# Altium project UVLO_MODULE.PrjPcb
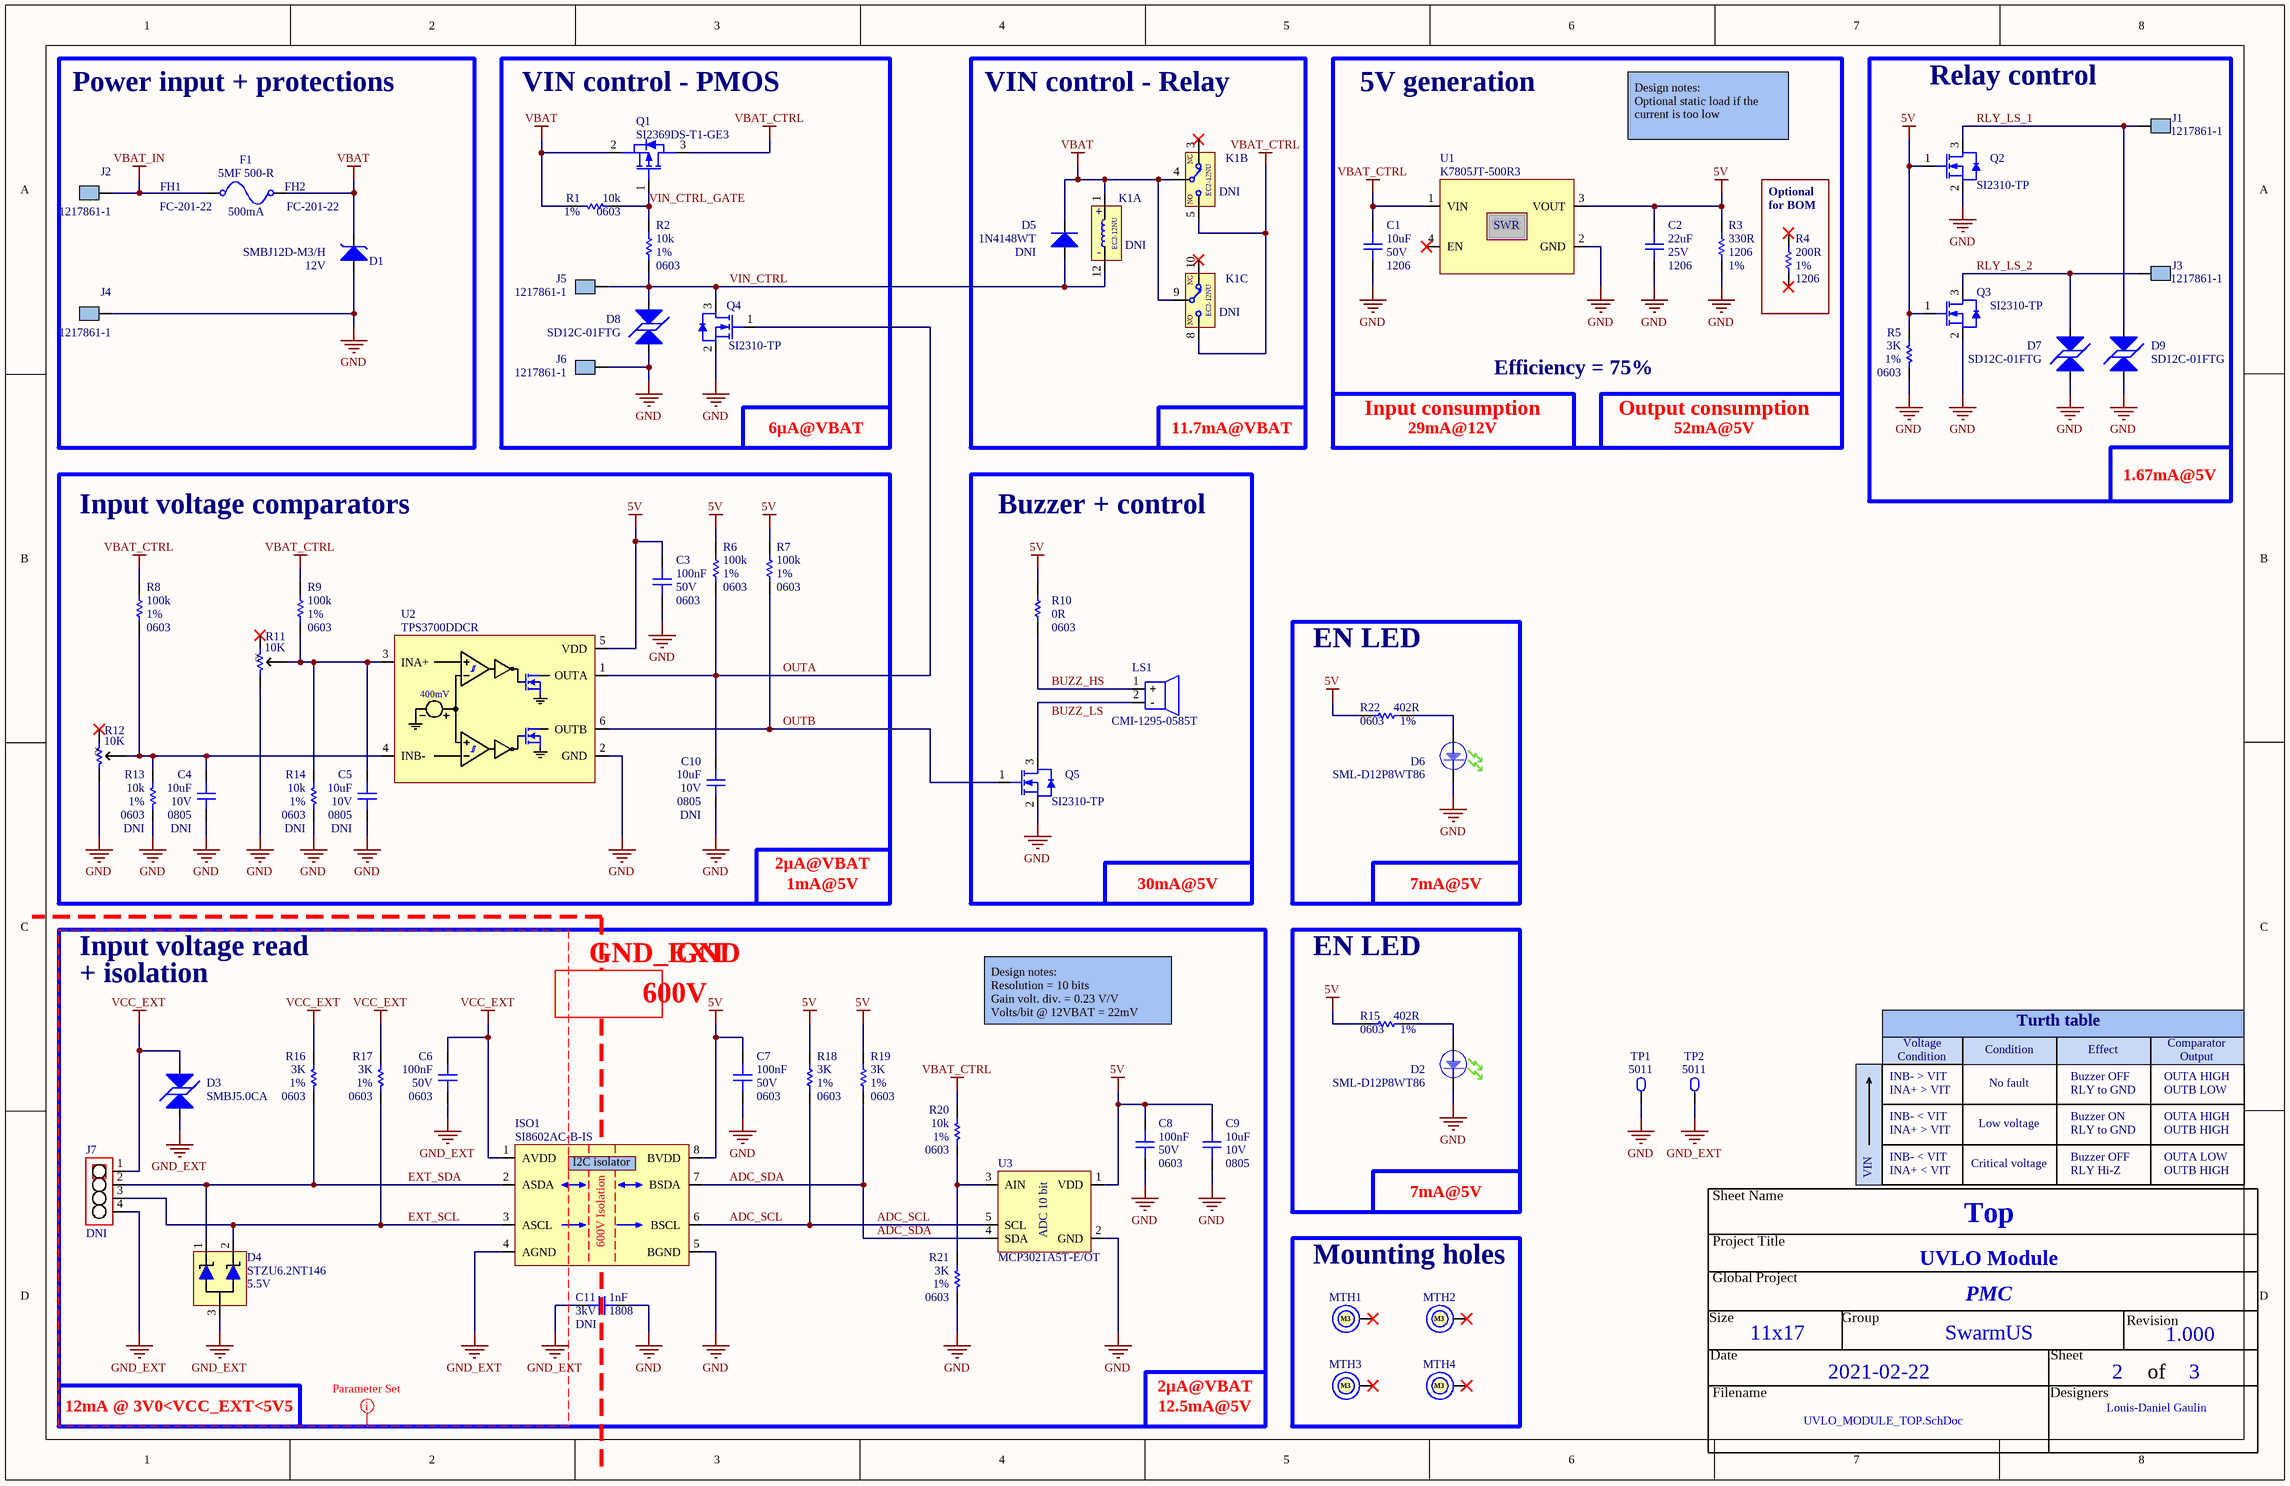
[diagram p0: UVLO_MODULE_TOP.SchDoc]
Project_Date: 2021-02-22; Project_Designer1: Louis-Daniel Gaulin; Project_Global: PMC; Project_Group: SwarmUS; Project_Name: UVLO Module; Project_Revision: 1.000; Project_Stencil_Bot_Thickness: 0.1 MM; Project_Stencil_Top_Thickness: 0.1 MM
1 sheet, 69 parts. Net scope: hierarchical (ports join the sheet entries above them; power ports are global).
Board file: UVLO_MODULE.PcbDoc

## Sheet UVLO_MODULE_TOP.SchDoc
size Tabloid; SheetNumber: 2; SheetTotal: 3; Sheet_Name: Top; Size: 11x17

### Parts
C1  value 10uF  Package: 1206  Voltage Rating: 50V  [CAP_CER_1206]  (hidden comment: GRT31CR61H106KE01L)
C2  value 22uF  Package: 1206  Voltage Rating: 25V  [CAP_CER_1206]  (hidden comment: CL31A226KAHNNNE)
C3  value 100nF  Package: 0603  Voltage Rating: 50V  [CAP_CER_0603]  (hidden comment: CC0603KRX7R9BB104)
C4  value 10uF  Assembly Note: DNI  Package: 0805  Voltage Rating: 10V  [CAP_CER_0805]  (hidden comment: LMK212BJ106KG-T)
C5  value 10uF  Assembly Note: DNI  Package: 0805  Voltage Rating: 10V  [CAP_CER_0805]  (hidden comment: LMK212BJ106KG-T)
C6  value 100nF  Package: 0603  Voltage Rating: 50V  [CAP_CER_0603]  (hidden comment: CC0603KRX7R9BB104)
C7  value 100nF  Package: 0603  Voltage Rating: 50V  [CAP_CER_0603]  (hidden comment: CC0603KRX7R9BB104)
C8  value 100nF  Package: 0603  Voltage Rating: 50V  [CAP_CER_0603]  (hidden comment: CC0603KRX7R9BB104)
C9  value 10uF  Package: 0805  Voltage Rating: 10V  [CAP_CER_0805]  (hidden comment: LMK212BJ106KG-T)
C10  value 10uF  Assembly Note: DNI  Package: 0805  Voltage Rating: 10V  [CAP_CER_0805]  (hidden comment: LMK212BJ106KG-T)
C11  value 1nF  Assembly Note: DNI  Package: 1808  Voltage Rating: 3kV  [CAP_CER_1808]  (hidden comment: 1808HC102KAT1A)
D1  SMBJ12D-M3/H  value 12V  [TVS_SMBJ12D-M3/H]
D2  SML-D12P8WT86  [LED_SML-D12P8WT86]
D3  SMBJ5.0CA  [TVS_PWR_SMBJ5.0CA]
D4  STZU6.2NT146  Voltage Rating: 5.5V  [TVS_DATA_STZU6.2NT146]
D5  1N4148WT  Assembly Note: DNI  [DIO_1N4148WT]
D6  SML-D12P8WT86  [LED_SML-D12P8WT86]
D7  SD12C-01FTG  [TVS_DATA_SD12C-01FTG]
D8  SD12C-01FTG  [TVS_DATA_SD12C-01FTG]
D9  SD12C-01FTG  [TVS_DATA_SD12C-01FTG]
F1  5MF 500-R  Current Rating: 500mA  [FUS_5MF 500-R]
FH1  FC-201-22  [FHO_FC-201-22]
FH2  FC-201-22  [FHO_FC-201-22]
ISO1  SI8602AC-B-IS  [ISO_SI8602AC-B-IS]
J1  1217861-1  [CON_1217861-1]
J2  1217861-1  [CON_1217861-1]
J3  1217861-1  [CON_1217861-1]
J4  1217861-1  [CON_1217861-1]
J5  1217861-1  [CON_1217861-1]
J6  1217861-1  [CON_1217861-1]
J7  Assembly Note: DNI  [CON_HDR_1X4]  (hidden comment: CON_HDR_1X4)
K1  EC2-12NU  Assembly Note: DNI  [RLY_EC2-12NU]  (parts A,B,C of 3)
LS1  CMI-1295-0585T  [UND_SPK_CMI-1295-0585T]
MTH1  M3  [MTH_M3]  (no BOM)
MTH2  M3  [MTH_M3]  (no BOM)
MTH3  M3  [MTH_M3]  (no BOM)
MTH4  M3  [MTH_M3]  (no BOM)
Q1  SI2369DS-T1-GE3  [TRX_PMOS_SI2369DS-T1-GE3]
Q2  SI2310-TP  [TRX_NMOS_SI2310-TP]
Q3  SI2310-TP  [TRX_NMOS_SI2310-TP]
Q4  SI2310-TP  [TRX_NMOS_SI2310-TP]
Q5  SI2310-TP  [TRX_NMOS_SI2310-TP]
R1  value 10k  Tolerance: 1%  Package: 0603  [RES_0603]  (hidden comment: RC0603FR-0710KL)
R2  value 10k  Tolerance: 1%  Package: 0603  [RES_0603]  (hidden comment: RC0603FR-0710KL)
R3  value 330R  Tolerance: 1%  Package: 1206  [RES_1206]  (hidden comment: RC1206FR-07330RL)
R4  value 200R  Tolerance: 1%  Package: 1206  [RES_1206]  (hidden comment: CRCW1206200RFKEAC)  (mechanical)
R5  value 3K  Tolerance: 1%  Package: 0603  [RES_0603]  (hidden comment: RC0603FR-073KL)
R6  value 100k  Tolerance: 1%  Package: 0603  [RES_0603]  (hidden comment: RC0603FR-07100KL)
R7  value 100k  Tolerance: 1%  Package: 0603  [RES_0603]  (hidden comment: RC0603FR-07100KL)
R8  value 100k  Tolerance: 1%  Package: 0603  [RES_0603]  (hidden comment: RC0603FR-07100KL)
R9  value 100k  Tolerance: 1%  Package: 0603  [RES_0603]  (hidden comment: RC0603FR-07100KL)
R10  value 0R  Package: 0603  [RES_0603]  (hidden comment: RC0603JR-070RL)
R11  value 10K  [POT_3362P-1-103LF]  (hidden comment: 3362P-1-103LF)
R12  value 10K  [POT_3362P-1-103LF]  (hidden comment: 3362P-1-103LF)
R13  value 10k  Assembly Note: DNI  Tolerance: 1%  Package: 0603  [RES_0603]  (hidden comment: RC0603FR-0710KL)
R14  value 10k  Assembly Note: DNI  Tolerance: 1%  Package: 0603  [RES_0603]  (hidden comment: RC0603FR-0710KL)
R15  value 402R  Tolerance: 1%  Package: 0603  [RES_0603]  (hidden comment: RC0603FR-07402RL)
R16  value 3K  Tolerance: 1%  Package: 0603  [RES_0603]  (hidden comment: RC0603FR-073KL)
R17  value 3K  Tolerance: 1%  Package: 0603  [RES_0603]  (hidden comment: RC0603FR-073KL)
R18  value 3K  Tolerance: 1%  Package: 0603  [RES_0603]  (hidden comment: RC0603FR-073KL)
R19  value 3K  Tolerance: 1%  Package: 0603  [RES_0603]  (hidden comment: RC0603FR-073KL)
R20  value 10k  Tolerance: 1%  Package: 0603  [RES_0603]  (hidden comment: RC0603FR-0710KL)
R21  value 3K  Tolerance: 1%  Package: 0603  [RES_0603]  (hidden comment: RC0603FR-073KL)
R22  value 402R  Tolerance: 1%  Package: 0603  [RES_0603]  (hidden comment: RC0603FR-07402RL)
TP1  5011  [TPO_5011]
TP2  5011  [TPO_5011]
U1  K7805JT-500R3  [REG_SWR_K7805JT-500R3]
U2  TPS3700DDCR  [CMP_TPS3700DDCR]
U3  MCP3021A5T-E/OT  [ADC_MCP3021A5T-E/OT]

### Blocks framed on the sheet
Power input + protections: D1 F1 FH1 FH2 J2 J4
VIN control - PMOS: D8 J5 J6 Q1 Q4 R1 R2
VIN control - Relay: D5 K1
5V generation: C1 C2 R3 R4 U1
Relay control: D7 D9 J1 J3 Q2 Q3 R5
Input voltage comparators: C3-C5 C10 R6-R9 R11-R14 U2
Buzzer + control: LS1 Q5 R10
EN LED: D6 R22
EN LED: D2 R15
Mounting holes: MTH1-MTH4

### Nets
5V: C2.2 C3.2 C7.2 C8.2 C9.2 ISO1.8(BVDD) Q2.1(G) Q3.1(G) R3.2 R5.2 R6.2 R7.2 R10.2 R15.1 R18.2 R19.2 R22.1 U1.3(VOUT) U2.5(VDD) U3.1(VDD)
GND: C1.1 C2.1 C3.1 C4.1 C5.1 C7.1 C8.1 C9.1 C10.1 C11.1 D1.1(A) D2.K D6.K D7.2 D8.2 D9.2 ISO1.5(BGND) J4.1 J6.1 Q2.2(S) Q3.2(S) Q4.2(S) Q5.2(S) R3.1 R5.1 R11.1 R12.1 R13.1 R14.1 R21.1 TP1.1 U1.2(GND) U2.2(GND) U3.2(GND)
GND_EXT: C6.1 C11.2 D3.2 D4.3(A) ISO1.4(AGND) J7.4 TP2.1
VBAT: D1.2(K) D5.K FH2.1 K1.1(COIL+) K1.4(COM1) K1.9(COM2) Q1.2(S) R1.2
VBAT_CTRL: C1.2 K1.5(NO1) K1.8(NO2) Q1.3(D) R8.2 R9.2 R20.2 U1.1(VIN)
VBAT_IN: FH1.1 J2.1
VCC_EXT: C6.2 D3.1 ISO1.1(AVDD) J7.1 R16.2 R17.2
ADC_SCL: ISO1.6(BSCL) R18.1 U3.5(SCL)
ADC_SDA: ISO1.7(BSDA) R19.1 U3.4(SDA)
BUZZ_HS: LS1.1(+) R10.1
BUZZ_LS: LS1.2(-) Q5.3(D)
EXT_SCL: D4.2(K2) ISO1.3(ASCL) J7.3 R17.1
EXT_SDA: D4.1(K1) ISO1.2(ASDA) J7.2 R16.1
OUTA: C10.2 Q4.1(G) R6.1 U2.1(OUTA)
OUTB: Q5.1(G) R7.1 U2.6(OUTB)
RLY_LS_1: D9.1 J1.1 Q2.3(D)
RLY_LS_2: D7.1 J3.1 Q3.3(D)
VIN_CTRL: D5.A D8.1 J5.1 K1.12(COIL-) Q4.3(D) R2.1
VIN_CTRL_GATE: Q1.1(G) R1.1 R2.2
NetC4_2: C4.2 R8.1 R12.2 R13.2 U2.4(INB-)
NetC5_2: C5.2 R9.1 R11.2 R14.2 U2.3(INA+)
NetD2_A: D2.A R15.2
NetD6_A: D6.A R22.2
NetR20_1: R20.1 R21.2 U3.3(AIN)

Not connected (* = marked no-connect by the designer): K1 3(NC1)* 10(NC2)*; MTH1 1*; MTH2 1*; MTH3 1*; MTH4 1*; R4 1* 2*; R11 3*; R12 3*; U1 4(EN)*

### Layout directives
net class EXT: EXT_SCL, EXT_SDA, GND_EXT, VCC_EXT

### Notes on the sheet
- Design notes:
  Optional static load if the current is too low
- Optional
- for BOM
- 6µA@VBAT
- 11.7mA@VBAT
- 29mA@12V
- Input consumption
- Efficiency = 75%
- 52mA@5V
- Output consumption
- 1.67mA@5V
- 1mA@5V
- 2µA@VBAT
- 30mA@5V
- 7mA@5V
- Input voltage read
- GND_EXT
- GND
- + isolation
- 600V
- Design notes:
  Resolution = 10 bits
  Gain volt. div. = 0.23 V/V
  Volts/bit @ 12VBAT = 22mV
- Turth table
- INB- > VIT
- INA+ > VIT
- Voltage
- Condition
- No fault
- Buzzer OFF
- RLY to GND
- Effect
- OUTA HIGH
- OUTB LOW
- Comparator
- Output
- INB- < VIT
- Low voltage
- Critical voltage
- Buzzer ON
- OUTA LOW
- OUTB HIGH
- VIN
- INA+ < VIT
- RLY Hi-Z
- 12mA @ 3V0<VCC_EXT<5V5
- 12.5mA@5V
- Sheet Name
- Project Title
- Global Project
- Revision
- Size
- Date
- Group
- Sheet
- of
- Filename
- Designers
- (in symbol ADC_MCP3021A5T-E/OT) ADC 10 bit
- (in symbol CMP_TPS3700DDCR) 400mV
- (in symbol ISO_SI8602AC-B-IS) I2C isolator
- (in symbol POT_3362P-1-103LF) CW
- (in symbol REG_SWR_K7805JT-500R3) SWR
- (in symbol RLY_EC2-12NU, part A) +; -
- (in symbol RLY_EC2-12NU, part B) NC; NO
- (in symbol RLY_EC2-12NU, part C) NC; NO

### Library data of the parts
C1 = CAP_CER_GRT31CR61H106KE01L: CAP - CER 10UF 10% 50V X5R - 1206; Manufacturer #1: Murata Electronics North America; GRAMS Lib Spec: 2.8; Magnetic Material: Unknown; Polarized: No; Tolerance: 10%; Current Rating: *; Power Max: *; HelpURL: https://search.murata.co.jp/Ceramy/image/img/A01X/G101/ENG/GRT31CR61H106KE01-01.pdf; CreatedBy/Date: Nicolas Roy - 2018/12/19; VerifiedBy: Nicolas V. (2019-01-22); Temperature: -55°C ~ 85°C; Manufacturer #2: *; Note: *; Assembly Type: SMD; Part Number #2: *; Part Number #1: GRT31CR61H106KE01L; Supplier 1: Digi-Key; Supplier Part Number 1: 490-12456-1-ND; Cryo: UNKNOWN
C2 = CAP_CER_CL31A226KAHNNNE: CAP - CER 22uF 10% 25V X5R - 1206; Manufacturer #1: Samsung Electro-Mechanics; GRAMS Lib Spec: 2.8; Magnetic Material: Unknown; Polarized: NO; Assembly Type: SMD; CreatedBy/Date: Philippe Arsenault/21 Janvier 2020; Current Rating: *; HelpURL: http://www.samsungsem.com/global/support/product-search/mlcc/1207445_4880.html; Manufacturer #2: *; Note: *; Part Number #1: CL31A226KAHNNNE; Part Number #2: 1276-3047-1-ND; Power Max: *; Temperature: -55°C ~ 85°C; Tolerance: 10%; VerifiedBy: C.Paulin - 28/01/2020; Supplier 1: Digi-Key; Supplier Part Number 1: 1276-3047-1-ND; Cryo: UNKNOWN
C3 C6-C8 = CAP_CER_CC0603KRX7R9BB104: CAP - CER 100nF 50V X7R - 0603; Manufacturer #1: Yageo; Tolerance: 10%; GRAMS Lib Spec: 2.8; Magnetic Material: UNKNOWN; Polarized: NO; Current Rating: *; Power Max: *; HelpURL: https://www.yageo.com/upload/media/product/productsearch/datasheet/mlcc/UPY-GPHC_X7R_6.3V-to-50V_18.pdf; CreatedBy/Date: Louis-Daniel Gaulin / 25-02-2021; VerifiedBy: Hubert Dube - 26/02/2021; Temperature: -55°C ~ 125°C; Manufacturer #2: *; Note: *; Assembly Type: SMD; Part Number #2: *; Part Number #1: CC0603KRX7R9BB104; Supplier 1: Digi-Key; Supplier Part Number 1: 311-1344-1-ND; Cryo: UNKNOWN
C4 C5 C9 C10 = CAP_CER_LMK212BJ106KG-T: CAP - CER 10UF 10% 10V X5R - 0805; Manufacturer #1: Taiyo Yuden; GRAMS Lib Spec: 2.8; Magnetic Material: Unknown; Polarized: NO; Assembly Type: SMD; CreatedBy/Date: Caroline Paulin / 25 juillet 2018; Current Rating: *; HelpURL: https://www.yuden.co.jp/productdata/catalog/mlcc_all_e.pdf; Manufacturer #2: *; Note: *; Part Number #1: LMK212BJ106KG-T; Part Number #2: *; Power Max: *; Temperature: -55°C ~ 85°C; Tolerance: 10%; VerifiedBy: Nicolas V. (2019-01-22); Supplier 1: Digi-Key; Supplier Part Number 1: 587-1300-1-ND; Cryo: UNKNOWN
C11 = CAP_CER_1808HC102KAT1A: CAP - CER 1nF 10% 3kV X7R - 1808; Manufacturer #1: AVX Corporation; GRAMS Lib Spec: 2.8; Magnetic Material: Unknown; Polarized: No; Assembly Type: SMD; CreatedBy/Date: Joel Lemay 2018-08-29; Current Rating: *; HelpURL: http://datasheets.avx.com/AVX-HV_MLCC.pdf; Manufacturer #2: *; Part Number #1: 1808HC102KAT1A; Part Number #2: *; Power Max: *; Temperature: -55°C ~ 125°C; Tolerance: 10%; VerifiedBy: Caroline Paulin - 7 sept 2018; Supplier 1: Digi-Key; Supplier Part Number 1: 478-2981-1-ND; Cryo: UNKNOWN
D1 = TVS_SMBJ12D-M3/H: TVS - DIODE 12V 19.6V - DO-214AA; Manufacturer #1: Vishay Semiconductor Diodes Division; Current Rating: 30.6A peak pulse; GRAMS Lib Spec: 2.8c; Magnetic Material: Unknown; Polarized: Yes; Power Max: 600W peak pulse; Voltage Rating: Vbr = 13.5, Vc = 19.6; CreatedBy/Date: Joel Lemay 2019-04-17; HelpURL: http://www.vishay.com/docs/87606/87606.pdf; Manufacturer #2: *; Package: DO-214AA; Part Number #1: SMBJ12D-M3/H; Part Number #2: *; Supplier 1: Digi-Key; Supplier Part Number 1: SMBJ12D-M3/HGICT-ND; Temperature: -55°C ~ 150°C; Tolerance: *; VerifiedBy: C.Paulin 6/02/2020; Assembly Type: SMD; Cryo: UNKNOWN
D2 D6 = LED_SML-D12P8WT86: LED - GREEN DIFFUSED 0603 SMD - 0603; Manufacturer #1: Rohm Semiconductor; Current Rating: 1-20mA; Note: Operate at 2mA; Value: 560 nm (green); Voltage rating: 2.2V (Forward), 5V (max Reverse); Polarized: Yes; Magnetic Material: Unknown; GRAMS Lib Spec: 2.8; Manufacturer #2: *; Power Max: *; Part Number #1: SML-D12P8WT86; Part Number #2: *; HelpURL: https://d1d2qsbl8m0m72.cloudfront.net/en/products/databook/datasheet/opto/led/chip_mono/sml-d12x8_d13x8-e.pdf; Supplier 1: Digi-Key; Supplier Part Number 1: 511-1579-2-ND; Assembly Type: SMD; Temperature: -40 ~ 85 °C; Package: 0603; CreatedBy/Date: Keven Deslandes - 2018/11/21; Tolerance: *; VerifiedBy: Caroline Paulin - 13 février 2019; Cryo: UNKNOWN
D3 = TVS_PWR_SMBJ5.0CA: TVS - BIDIR 5V 9.2V 600W - DO214AA; Manufacturer #1: Littelfuse Inc.; Value: Vbr = 6.4V -  Clamp = 9.2V; Voltage Rating: 5V Standoff; Current Rating: 65.3 A (Ipp); Power Max: 600W (Pppm); GRAMS Lib Spec: 2.8; Magnetic Material: UNKNOWN; Polarized: NO; Tolerance: *; HelpURL: http://www.littelfuse.com/~/media/electronics/datasheets/tvs_diodes/littelfuse_tvs_diode_smbj_datasheet.pdf.pdf; CreatedBy/Date: Jonathan Bouchard - 2019-03-22; VerifiedBy: Nicolas V. (2019-05-06); Temperature: -65°C ~ 150°C (TJ); Package: DO214AA; Manufacturer #2: *; Note: *; Assembly Type: SMD; Part Number #2: *; Part Number #1: SMBJ5.0CA; Supplier 1: Digi-Key; Supplier Part Number 1: SMBJ5.0CALFCT-ND; Cryo: UNKNOWN
D4 = TVS_DATA_STZU6.2NT146: TVS - TVS DIODE 5.5V 5.9V - SOT-23-3; Manufacturer #1: Rohm Semiconductor; Power Max: 0.2W; GRAMS Lib Spec: 2.8; Magnetic Material: Unknown; Polarized: No; Value: *; Tolerance: *; Current Rating: *; HelpURL: https://d1d2qsbl8m0m72.cloudfront.net/en/products/databook/datasheet/discrete/diode/zener/stzu6.2nt146-e.pdf; CreatedBy/Date: Louis-Daniel Gaulin / 02-03-2021; VerifiedBy: Philippe Arsenault / 02-03-2021; Temperature: 150°C (TJ)/ -55 to 150°C (ST); Package: SOT-23-3; Manufacturer #2: *; Note: *; Assembly Type: SMD; Part Number #2: *; Part Number #1: STZU6.2NT146; Supplier 1: Digi-Key; Supplier Part Number 1: 846-STZU6.2NT146CT-ND; Cryo: UNKNOWN
D5 = DIO_1N4148WT: DIO - 1N4148WT - SOD-523F; Manufacturer #1: On Semiconductor; Current Rating: 200mA; GRAMS Lib Spec: 2.8; Magnetic Material: UNKNOWN; Polarized: Yes; Power Max: 200mW; Value: 1V @ 10mA; Voltage Rating: 75V; Assembly Type: SMD; CreatedBy/Date: Joel Lemay 2018-06-15; HelpURL: https://www.fairchildsemi.com/datasheets/1N/1N914BWT.pdf; Manufacturer #2: *; Note: *; Package: SOD-523F; Part Number #1: 1N4148WT; Part Number #2: *; Supplier 1: Digi-Key; Supplier Part Number 1: 1N4148WTCT-ND; Temperature: -55°C ~ 150°C; Tolerance: *; VerifiedBy: Arnaud Samson 17-07-18; Cryo: UNKNOWN
D7-D9 = TVS_DATA_SD12C-01FTG: TVS - BIDIR 12V 450W - SOD-323; Manufacturer #1: Littelfuse Inc.; Value: Vbr = 13.3V -  Clamp = 18.5V; Voltage Rating: 12V Standoff; Current Rating: 17.0 A (Ipp); Power Max: 450W (Ppk); GRAMS Lib Spec: 2.9; Magnetic Material: UNKNOWN; Polarized: NO; Tolerance: *; HelpURL: https://www.littelfuse.com/~/media/electronics/datasheets/tvs_diode_arrays/littelfuse_tvs_diode_array_sd_c_datasheet.pdf.pdf; CreatedBy/Date: O.D.Frenette - 2020-09-01; VerifiedBy: C.Paulin - 2020-09-09; Temperature: -40°C ~ 125°C (TJ); Package: SOD-323; Manufacturer #2: *; Note: *; Assembly Type: SMD; Part Number #2: *; Part Number #1: SD12C-01FTG; Supplier 1: Digi-Key; Supplier Part Number 1: F6442CT-ND; Cryo: UNKNOWN
F1 = FUS_5MF 500-R: FUS - CARTRIDGE GLASS 500mA 250VAC/125VDC - 5X20mm; Manufacturer #1: Bel Fuse Inc.; Value: 500mA, Fast blow; GRAMS Lib Spec: 2.8c; Note: Use with 2x FC-201-22 clip; Magnetic Material: UNKNOWN; Polarized: NO; Rule: UNIONINDEX=0|RULEKIND=ComponentClearance|NETSCOPE=AnyNet|LAYERKIND=SameLayer|NAME=Schematic Component Clearance Constraint|GAP=0mil|COLLISIONCHECKMODE=3|VERTICALGAP=0mil|SHOWDISTANCES=FALSE|UNIT=Imperial; Tolerance: *; Power Max: *; HelpURL: https://belfuse.com/resources/datasheets/circuitprotection/ds-cp-5mf-5mfp-series.pdf; CreatedBy/Date: Louis-Daniel Gaulin; VerifiedBy: Hubert Dube - 26/02/2021; Temperature: -55°C ~ 125°C; Package: 3AB; Manufacturer #2: *; Assembly Type: MANUAL; Part Number #2: *; Part Number #1: 5MF 500-R; Supplier 1: Digi-Key; Supplier Part Number 1: 507-1259-ND; Voltage Rating: 250VAC/125VDC; Cryo: UNKNOWN
FH1 FH2 = FHO_FC-201-22: FHO - FUSE CLIP 5mm CARTRIDGE 10A PCB - 2-TH; Manufacturer #1: Bel Fuse Inc.; Value: for 5mm diameter fuses; GRAMS Lib Spec: 2.8; Magnetic Material: UNKNOWN; Polarized: Yes; Tolerance: *; Power Max: *; HelpURL: https://belfuse.com/resources/datasheets/circuitprotection/ds-cp-0672-fuse-clips-series.pdf; CreatedBy/Date: Louis-Daniel Gaulin / 26-02-2021; VerifiedBy: Hubert Dube - 26/02/2021; Temperature: *; Package: 2-TH; Manufacturer #2: *; Note: *; Assembly Type: TH; Part Number #2: *; Part Number #1: FC-201-22; Supplier 1: Digi-Key; Supplier Part Number 1: FC-201-22-ND; Voltage Rating: *; Current Rating: 10A; Cryo: UNKNOWN
ISO1 = ISO_SI8602AC-B-IS: ISO - DGTL ISO 600V 2CH I2C  - 8-SOIC; Manufacturer #1: Silicon Labs; Polarized: YES; Magnetic Material: UNKNOWN; Value: 600V Isolation; GRAMS Lib Spec: 2.8; Voltage Rating: 3 V ~ 5.5 V; Current Rating: *; Manufacturer #2: *; Power Max: *; Part Number #1: SI8602AC-B-IS; Part Number #2: *; HelpURL: https://www.silabs.com/documents/public/data-sheets/Si860x.pdf; Note: *; Supplier 1: Digi-Key; Supplier Part Number 1: 336-2050-5-ND; Assembly Type: SMD; Package: 8-SOIC; Temperature: -40°C ~ 125°C; CreatedBy/Date: Louis-Daniel Gaulin / 25-02-2021; Tolerance: *; VerifiedBy: Hubert Dube - 26/02/2021; Cryo: UNKNOWN
J1-J6 = CON_1217861-1: CON - Quick connect tab - TH; Manufacturer #1: TE Connectivity AMP Connectors; Value: 250 mills; GRAMS Lib Spec: 2.8; Magnetic Material: Unknown; Polarized: Yes; Tolerance: -; Voltage Rating: *; Current Rating: -; Power Max: -; HelpURL: https://www.te.com/commerce/DocumentDelivery/DDEController?Action=srchrtrv&DocNm=1217861&DocType=Customer+Drawing&DocLang=English; CreatedBy/Date: Louis-Daniel Gaulin / 24-02-2021; VerifiedBy: Hubert Dube - 26/02/2021; Temperature: -; Package: TH; Manufacturer #2: -; Assembly Type: TH; Part Number #2: -; Part Number #1: 1217861-1; Supplier 1: Digi-Key; Supplier Part Number 1: A100452CT-ND; Cryo: UNKNOWN
J7 = CON_HDR_1X4: CON - Header 1X4 pins, 100Mils - TH-4; Polarized: No; Magnetic Material: UNKNOWN; GRAMS Lib Spec: 2.8; Manufacturer #1: *; Current Rating: *; Power Max: *; Voltage Rating: *; Manufacturer #2: *; Note: *; Part Number #2: *; HelpURL: *; Package: TH-4; Assembly Type: TH; Temperature: *; CreatedBy/Date: Nicolas V (2020-02-24); Tolerance: *; VerifiedBy: Nicolas V (2020-02-24); Cryo: UNKNOWN
K1 = RLY_EC2-12NU: RLY - GENERAL PURPOSE DPDT 2A 12V - TH-8; Manufacturer #1: KEMET; Value: 5V Coil; Voltage Rating: 250VAC, 220VDC - Max; GRAMS Lib Spec: 2.8; Magnetic Material: YES; Cryo: UNKNOWN; Tolerance: *; Current Rating: 2A; Power Max: *; HelpURL: https://content.kemet.com/datasheets/KEM_R7002_EC2_EE2.pdf; CreatedBy/Date: Louis-Daniel Gaulin/02-03-2021; VerifiedBy: Philippe Arsenault/02-03-2021; Temperature: -40°C ~ 85°C; Manufacturer #2: *; Note: *; Assembly Type: TH; Part Number #2: *; Part Number #1: EC2-12NU; Supplier 1: Digi-Key; Supplier Part Number 1: 399-11029-5-ND; Polarized: YES; Package: 8-TH
LS1 = UND_LS_CMI-1295-0585T: LS - Buzzer indicator 5V 30mA 2.3kHz 85dB - TH; Manufacturer #1: CUI Devices; Value: 85dB @ 5V, 10cm; Voltage Rating: 4 ~ 7V; GRAMS Lib Spec: 2.8; Magnetic Material: Unknown; Polarized: Yes; Tolerance: -; Current Rating: 30 mA; Power Max: -; HelpURL: https://www.cuidevices.com/product/resource/cmi-1295-0585t.pdf; CreatedBy/Date: Louis-Daniel Gaulin / 24-02-2021; VerifiedBy: Hubert Dube - 26/02/2021; Temperature: -40°C ~ 85°C; Package: TH; Manufacturer #2: -; Assembly Type: TH; Part Number #2: -; Part Number #1: CMI-1295-0585T; Supplier 1: Digi-Key; Supplier Part Number 1: 102-CMI-1295-0585T-ND; Cryo: UNKNOWN
MTH1-MTH4 = MTH_M3: MTH - MOUNTING HOLE M3 PLATED - M3; GRAMS Lib Spec: 2.8; Magnetic Material: NO; Cryo: UNKNOWN; Value: *; Tolerance: *; Voltage Rating: *; Current Rating: *; Power Max: *; HelpURL: https://littlemachineshop.com/images/gallery/PDF/TapDrillSizes.pdf; CreatedBy/Date: Jonathan Bouchard 2018-07-23; VerifiedBy: Arnaud Samson 23-07-18; Temperature: *; Package: M3; Manufacturer #1: *; Manufacturer #2: *; Note: *; Assembly Type: NONE; Part Number #2: *; Part Number #1: *; Polarized: *; Supplier 1: *; Supplier Part Number 1: *
Q1 = TRX_PMOS_SI2369DS-T1-GE3: TRX - PMOS 30V 7.6A - SOT−23; Manufacturer #1: Vishay Siliconix; GRAMS Lib Spec: 2.8; Magnetic Material: Unknown; Polarized: Yes; Power Max: 1.25W; Assembly Type: SMD; CreatedBy/Date: Louis-Daniel Gaulin / 30-07-2020; Current Rating: 7.6A; HelpURL: https://www.vishay.com/docs/62865/si2369d.pdf; Manufacturer #2: *; Package: SOT-23; Part Number #1: SI2369DS-T1-GE3; Part Number #2: *; Supplier 1: Digi-Key; Supplier Part Number 1: SI2369DS-T1-GE3CT-ND; Temperature: -55°C ~ 150°C; Tolerance: *; Value: *; VerifiedBy: Philippe Arsenault/2020-11-06; Voltage Rating: 30V; Cryo: UNKNOWN
Q2-Q5 = TRX_NMOS_SI2310-TP: TRX - MOSFET N-CH 60V 3A - SOT-23; Manufacturer #1: Micro Commercial Co; Power Max: 350mW; Voltage rating: 60V (Vds max), 2V (Vgs @ 250uA); Polarized: Yes; Magnetic Material: UNKNOWN; GRAMS Lib Spec: 2.8c; Current Rating: 3A; Manufacturer #2: *; Value: *; Part Number #1: SI2310-TP; Part Number #2: *; HelpURL: https://www.mccsemi.com/pdf/Products/SI2310(SOT-23)-A.pdf; Supplier 1: Digi-Key; Supplier Part Number 1: SI2310-TPMSCT-ND; Assembly Type: SMD; Temperature: -55°C ~ 150°C (TJ); Package: SOT-23; CreatedBy/Date: Louis-Daniel Gaulin / 20-02-2020; Tolerance: *; VerifiedBy: C.Paulin - 21/02/2020; Cryo: UNKNOWN
R1 R2 R13 R14 R20 = RES_RC0603FR-0710KL: RES - 10k 1% 1/10W - 0603; Manufacturer #1: Yageo; GRAMS Lib Spec: 2.8; Magnetic Material: Unknown; Polarized: No; Voltage Rating: 75V; Assembly Type: SMD; CreatedBy/Date: Louis-Daniel Gaulin / 24-02-2021; Current Rating: *; HelpURL: https://www.yageo.com/upload/media/product/productsearch/datasheet/rchip/PYu-RC_Group_51_RoHS_L_11.pdf; Manufacturer #2: *; Note: *; Part Number #1: RC0603FR-0710KL; Part Number #2: *; Power Max: 1/10W; Temperature: -55°C ~ 155°C; VerifiedBy: Hubert Dube - 26/02/2021; Supplier 1: Digi-Key; Supplier Part Number 1: 311-10.0KHRCT-ND
R3 = RES_RC1206FR-07330RL: RES - 330 OHM 1% 1/4W - 1206; Manufacturer #1: Yageo; GRAMS Lib Spec: 2.8; Magnetic Material: Unknown; Polarized: No; Voltage Rating: 200V; Assembly Type: SMD; CreatedBy/Date: Nicolas V. (2019-11-19); Current Rating: *; HelpURL: https://www.yageo.com/upload/media/product/productsearch/datasheet/rchip/PYu-RC_Group_51_RoHS_L_10.pdf; Manufacturer #2: *; Part Number #1: RC1206FR-07330RL; Part Number #2: *; Temperature: -55°C ~ 155°C; VerifiedBy: Nicolas V. (2019-11-19); Supplier 1: Digi-Key; Supplier Part Number 1: 311-330FRCT-ND; Power Max: 1/4W; Cryo: UNKNOWN
R4 = RES_CRCW1206200RFKEAC: RES - 200R 1% 1/4W - 1206; Manufacturer #1: Vishay Dale; GRAMS Lib Spec: 2.8; Magnetic Material: Unknown; Polarized: No; Voltage Rating: 75V; Assembly Type: SMD; CreatedBy/Date: Louis-Daniel Gaulin / 26-02-2021; Current Rating: *; HelpURL: https://www.vishay.com/docs/28773/crcwce3.pdf; Manufacturer #2: *; Note: *; Part Number #1: CRCW1206200RFKEAC; Part Number #2: *; Power Max: 1/4W; Temperature: -55°C ~ 155°C; VerifiedBy: Hubert Dubé/ 26-02-2021; Supplier 1: Digi-Key; Supplier Part Number 1: 541-4176-1-ND
R5 R16-R19 R21 = RES_RC0603FR-073KL: RES - 3k 1% 1/10W - 0603; Manufacturer #1: Yageo; GRAMS Lib Spec: 2.8; Magnetic Material: Unknown; Polarized: No; Voltage Rating: 75V; Assembly Type: SMD; CreatedBy/Date: Louis-Daniel Gaulin / 24-02-2021; Current Rating: *; HelpURL: https://www.yageo.com/upload/media/product/productsearch/datasheet/rchip/PYu-RC_Group_51_RoHS_L_11.pdf; Manufacturer #2: *; Note: *; Part Number #1: RC0603FR-073KL; Part Number #2: *; Power Max: 1/10W; Temperature: -55°C ~ 155°C; VerifiedBy: Hubert Dube - 26/02/2021; Supplier 1: Digi-Key; Supplier Part Number 1: 311-3.00KHRCT-ND
R6-R9 = RES_RC0603FR-07100KL: RES - 100k 1% 1/10W - 0603; Manufacturer #1: Yageo; GRAMS Lib Spec: 2.8; Magnetic Material: Unknown; Polarized: No; Voltage Rating: 75V; Assembly Type: SMD; CreatedBy/Date: Louis-Daniel Gaulin / 24-02-2021; Current Rating: *; HelpURL: https://www.yageo.com/upload/media/product/productsearch/datasheet/rchip/PYu-RC_Group_51_RoHS_L_11.pdf; Manufacturer #2: *; Note: *; Part Number #1: RC0603FR-07100KL; Part Number #2: *; Power Max: 1/10W; Temperature: -55°C ~ 155°C; VerifiedBy: Hubert Dube; Supplier 1: Digi-Key; Supplier Part Number 1: 311-100KHRCT-ND
R10 = RES_RC0603JR-070RL: RES - 0 ohm jumper 1/10W - 0603; Manufacturer #1: Yageo; GRAMS Lib Spec: 2.8; Magnetic Material: Unknown; Polarized: No; Assembly Type: SMD; CreatedBy/Date: L-P Gauthier 2018-10-30; Current Rating: *; HelpURL: http://www.yageo.com/documents/recent/PYu-RC_Group_51_RoHS_L_9.pdf; Manufacturer #2: *; Part Number #1: RC0603JR-070RL; Part Number #2: *; Power Max: 1/10W; Temperature: -55°C ~ 155°C; VerifiedBy: Caroline Paulin  - 5/11/2018; Voltage Rating: -; Supplier 1: Digi-Key; Supplier Part Number 1: 311-0.0GRCT-ND; Cryo: UNKNOWN
R11 R12 = POT_3362P-1-103LF: RES -  POT 10K 1/2W LINEAR PLASTIC 1 turn - TH; Manufacturer #1: Bourns Inc.; GRAMS Lib Spec: 2.8; Tolerance: 10%; Magnetic Material: Unknown; Polarized: YES; Voltage Rating: 500V; Assembly Type: TH; CreatedBy/Date: Louis-Daniel Gaulin / 24-02-2021; Current Rating: *; HelpURL: https://www.bourns.com/docs/Product-Datasheets/3362.pdf; Manufacturer #2: *; Note: *; Part Number #1: 3362P-1-103LF; Part Number #2: *; Power Max: 1/2W; Temperature: *; VerifiedBy: Hubert Dube - 26/02/2021; Supplier 1: Digi-Key; Supplier Part Number 1: 3362P-103LF-ND; Package: TH; Cryo: UNKNOWN
R15 R22 = RES_RC0603FR-07402RL: RES - 402R 1% 1/10W - 0603; Manufacturer #1: Yageo; GRAMS Lib Spec: 2.8; Magnetic Material: Unknown; Polarized: No; Voltage Rating: 75V; Assembly Type: SMD; CreatedBy/Date: Louis-Daniel Gaulin / 24-02-2021; Current Rating: *; HelpURL: https://www.yageo.com/upload/media/product/productsearch/datasheet/rchip/PYu-RC_Group_51_RoHS_L_11.pdf; Manufacturer #2: *; Note: *; Part Number #1: RC0603FR-07402RL; Part Number #2: *; Power Max: 1/10W; Temperature: -55°C ~ 155°C; VerifiedBy: Hubert Dube - 26/02/2021; Supplier 1: Digi-Key; Supplier Part Number 1: 311-402HRCT-ND
TP1 TP2 = TPO_5011: TPO - TEST POINT - TH; Manufacturer #1: Keystone Electronics; Polarized: No; Magnetic Material: UNKNOWN; GRAMS Lib Spec: 2.8; Current Rating: *; Manufacturer #2: *; Note: *; Power Max: *; Value: *; Part Number #1: 5011; Part Number #2: *; HelpURL: https://www.keyelco.com/userAssets/file/M65p56.pdf; Assembly Type: TH; Package: *; CreatedBy/Date: Louis-Daniel Gauli / 02-11-2020; Temperature: *; Tolerance: *; VerifiedBy: Philippe Arsenault/2020-11-06; Voltage Rating: *; Cryo: UNKNOWN; Supplier 1: Digi-Key; Supplier Part Number 1: 36-5011-ND
U1 = REG_SWR_K7805JT-500R3: REG_DC DC CONVERTER 5V 2.5W - 4-SMD Module; Manufacturer #1: Mornsun America, LLC; Voltage Rating: 6.5V to 36V IN; Current Rating: 0.5A; GRAMS Lib Spec: 2.8; Magnetic Material: Unknown; Polarized: Yes; Value: 5V; Tolerance: *; Power Max: *; HelpURL: https://www.mornsun-power.com/html/pdf/K7805JT-500R3.html; CreatedBy/Date: Louis-Daniel Gaulin / 25-02-2021; VerifiedBy: Hubert Dube - 26/02/2021; Temperature: -40°C ~ 85°C; Package: 4-SMD Module; Manufacturer #2: *; Note: *; Assembly Type: SMD; Part Number #2: *; Part Number #1: K7805JT-500R3; Supplier 1: Digi-Key; Supplier Part Number 1: 2725-K7805JT-500R3CT-ND; Cryo: UNKNOWN
U2 = CMP_TPS3700DDCR: CMP - Comparator Window Open Drain - TSOT-23-6; Manufacturer #1: Texas Instruments; Voltage Rating: 1.8V ~ 18V; Current Rating: 40mA; GRAMS Lib Spec: 2.8; Polarized: YES; Value: *; Tolerance: *; Power Max: *; HelpURL: https://www.ti.com/lit/ds/symlink/tps3700.pdf?ts=1613994469122&ref_url=https%253A%252F%252Fwww.ti.com%252Fproduct%252FTPS3700%253Futm_source%253Dgoogle%2526utm_medium%253Dcpc%2526utm_campaign%253Dapp-null-null-GPN_EN-cpc-pf-google-wwe%2526utm_content%253DTPS3700%2526ds_k%253DTPS3700%2526DCM%253Dyes%2526gclid%253DEAIaIQobChMI6PCR77X97gIVzUeRBR1hwwWTEAAYASAAEgJJbfD_BwE%2526gclsrc%253Daw.ds; CreatedBy/Date: Louis-Daniel Gaulin / 22-02-2021; VerifiedBy: Hubert Dube - 26/02/2021; Temperature: -40°C ~ 125°C; Package: TSOT-23-6; Manufacturer #2: *; Note: *; Assembly Type: SMT; Part Number #2: *; Part Number #1: TPS3700DDCR; Magnetic Material: *; Supplier 1: Digi-Key; Supplier Part Number 1: 296-30395-2-ND
U3 = ADC_MCP3021A5T-E/OT: ADC - IC ADC 10BIT I2C 22.3KSPS - SOT-23-5; Manufacturer #1: Microchip Technology; Note: Slave I2C Adress = 1001101; Value: 10 bit, 1 Channels, 22.3ksps; Voltage rating: 2.7V ~ 5.5V; Polarized: Yes; Magnetic Material: UNKNOWN; GRAMS Lib Spec: 2.8; Current Rating: *; Manufacturer #2: *; Power Max: *; Part Number #1: MCP3021A5T-E/OT; Part Number #2: *; HelpURL: https://ww1.microchip.com/downloads/en/DeviceDoc/20001805C.pdf; Supplier 1: Digi-Key; Supplier Part Number 1: MCP3021A5T-E/OTCT-ND; Assembly Type: SMD; Temperature: -40°C~125°C; Package: SOT-23-5; CreatedBy/Date: Louis-Daniel Gaulin / 24-02-2021; Tolerance: *; VerifiedBy: Hubert Dube - 26/02/2021; Cryo: UNKNOWN